# Altium project VCM.PrjPcb
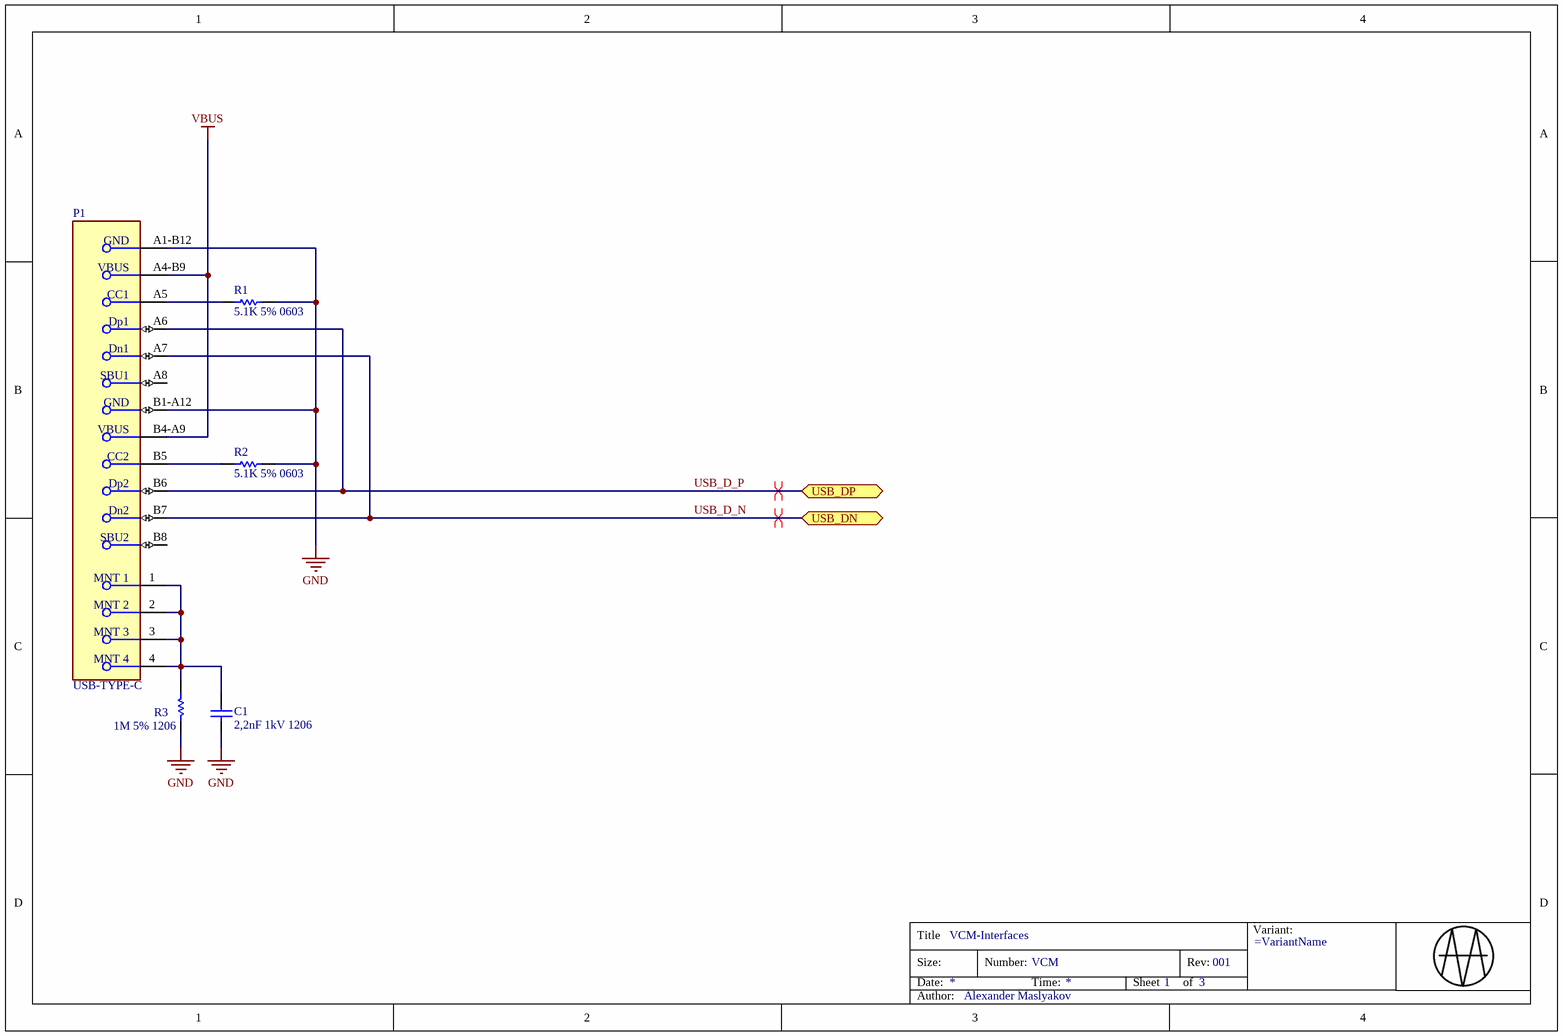
[diagram p0: VCM-Interfaces.SchDoc]
CompanyTitle: KS2Corp; PCB-SurfaceFinish: HASL; ProjectAuthor: Alexander Maslyakov; ProjectPartNumber: VCM; ProjectRevision: 001; ProjectTitle: VCM
3 sheets, 15 parts. Net scope: flat (ports and power ports of the same name join across sheets).
Board file: VCM.PcbDoc
Sheets:
  VCM-Interfaces.SchDoc
  VCM-MCU.SchDoc
  VCM-Power.SchDoc

## Sheet VCM-Interfaces.SchDoc: Interfaces
size A4; DocumentNumber: VCM; Revision: 001; SheetNumber: 1; SheetTotal: 3

### Parts
(Parts that share a designator on the sheet are numbered #1, #2 ... from top to bottom, then left to right.)
?#1  Sheet Title: VCM-Interfaces  Document Number: VCM  Revision Number: 001  Document Path and Name: Alexander Maslyakov  Total Sheets: 3  Sheet Number: 1  (hidden comment: Title Block Logo)  (graphical)
C1  2,2nF 1kV 1206  [CAPC3216X180X55LL20T25]
P1  USB-TYPE-C  [KH-TYPE-C-16P]
R1  5.1K 5% 0603  [RESC1609X55X30LL15T15]
R2  5.1K 5% 0603  [RESC1609X55X30LL15T15]
R3  1M 5% 1206  [RESC3116X65X45LL15T20]

### Ports
USB_DN (bidir), USB_DP (bidir)

### Nets
GND: C1.1 P1.A1-B12(GND) P1.B1-A12(GND) R1.2 R2.2 R3.1
VBUS: P1.A4-B9(VBUS) P1.B4-A9(VBUS)
USB_D_N: P1.A7(Dn1) P1.B7(Dn2) ; port USB_DN
USB_D_P: P1.A6(Dp1) P1.B6(Dp2) ; port USB_DP
NetC1_2: C1.2 P1.1 P1.2 P1.3 P1.4 R3.2
NetP1_A5: P1.A5(CC1) R1.1
NetP1_B5: P1.B5(CC2) R2.1

Not connected (* = marked no-connect by the designer): P1 A8(SBU1) B8(SBU2)

### Layout directives
differential pair: USB_D_N, USB_D_P

### Notes on the sheet
- Title
- Size:
- Date:
- A4
- Number:
- Time:
- Revision:
- Sheet
- of
- File:
- (in symbol Title Block Logo) Variant:; Title; Size:; Number:; Rev:; Date:; Time:; Sheet; of; Author:
- (in symbol USB-TYPE-C) MNT 1; MNT 2; MNT 3; MNT 4

### Library data of the parts
C1 = CAP1206: Chip Capacitor, 1206 (3216 Metric)
P1 = USB-TYPE-C: CONN USB 2.0 TYPE-C R/A SMT; Manufacturer: Shenzhen Kinghelm Elec; Number Of Contacts: 16; ComponentLink2URL: https://datasheet.lcsc.com/lcsc/2009111434_Shenzhen-Kinghelm-Elec-KH-TYPE-C-16P_C709357.pdf; Manufacturer Part Number: KH-TYPE-C-16P; ComponentLink2Description: Datasheet; Supplier 1: LCSC; Supplier Part Number 1: C709357
R1 R2 = RES0603: Chip Resistor,  0603 (1608 Metric)l
R3 = RES1206: Chip Resistor,  1206 (3216 Metric)
?#1 = Title Block Logo: Organization Address 1: =VariantName; Date: *; Time: *

## Sheet VCM-MCU.SchDoc: MCU
size A4; DocumentNumber: VCM; Revision: 001; SheetNumber: 2; SheetTotal: 3
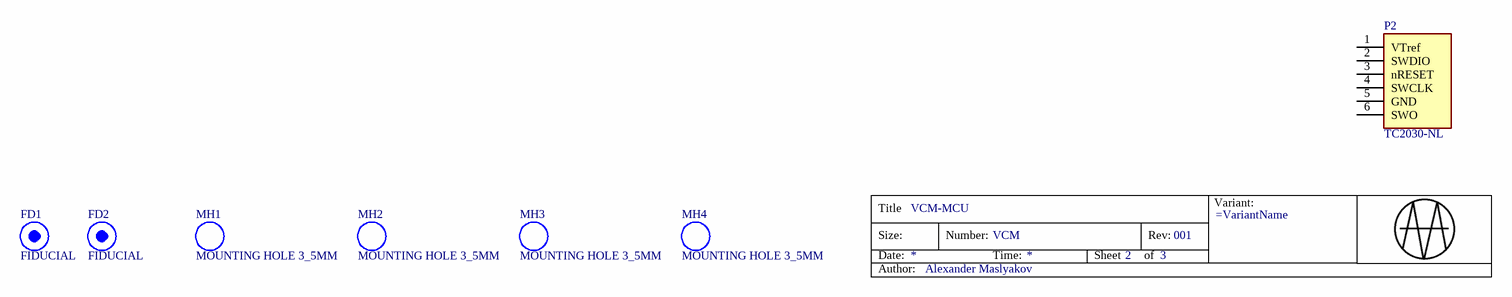
[diagram p1: VCM-MCU.SchDoc]

### Parts
(Parts that share a designator on the sheet are numbered #1, #2 ... from top to bottom, then left to right.)
?#2  Sheet Title: VCM-MCU  Document Number: VCM  Revision Number: 001  Document Path and Name: Alexander Maslyakov  Total Sheets: 3  Sheet Number: 2  (hidden comment: Title Block Logo)  (graphical)
FD1  FIDUCIAL  [FIDUCIAL_2MM]  (no BOM)
FD2  FIDUCIAL  [FIDUCIAL_2MM]  (no BOM)
MH1  MOUNTING HOLE 3_5MM  [MOUNTING-HOLE-3.5MM]  (no BOM)
MH2  MOUNTING HOLE 3_5MM  [MOUNTING-HOLE-3.5MM]  (no BOM)
MH3  MOUNTING HOLE 3_5MM  [MOUNTING-HOLE-3.5MM]  (no BOM)
MH4  MOUNTING HOLE 3_5MM  [MOUNTING-HOLE-3.5MM]  (no BOM)
P2  TC2030-NL  [TC2030-NL]  (no BOM)

### Nets

Not connected (* = marked no-connect by the designer): P2 1(VTref) 2(SWDIO) 3(nRESET) 4(SWCLK) 5(GND) 6(SWO)

### Notes on the sheet
- Title
- Size:
- Date:
- A4
- Number:
- Time:
- Revision:
- Sheet
- of
- File:
- (in symbol Title Block Logo) Variant:; Title; Size:; Number:; Rev:; Date:; Time:; Sheet; of; Author:

### Library data of the parts
MH1-MH4 = MOUNTING HOLE 3.5MM
?#2 = Title Block Logo: Organization Address 1: =VariantName; Date: *; Time: *

## Sheet VCM-Power.SchDoc: Power
size A4; DocumentNumber: VCM; Revision: 001; SheetNumber: 3; SheetTotal: 3
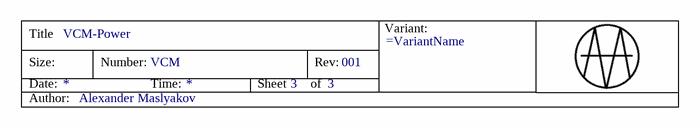
[diagram p2: VCM-Power.SchDoc]

### Parts
(Parts that share a designator on the sheet are numbered #1, #2 ... from top to bottom, then left to right.)
?#3  Sheet Title: VCM-Power  Document Number: VCM  Revision Number: 001  Document Path and Name: Alexander Maslyakov  Total Sheets: 3  (hidden comment: Title Block Logo)  (graphical)

### Notes on the sheet
- Title
- Size:
- Date:
- A4
- Number:
- Time:
- Revision:
- Sheet
- of
- File:
- (in symbol Title Block Logo) Variant:; Title; Size:; Number:; Rev:; Date:; Time:; Sheet; of; Author:

### Library data of the parts
?#3 = Title Block Logo: Organization Address 1: =VariantName; Date: *; Time: *; Sheet Number: 3